# EAGLE design Adafruit LED Arcade Button 1x4 (EAGLE 9.6.2)
COMPANY: ADAFRUIT INDUSTRIES; DRAWN: KTOWN; REV: A
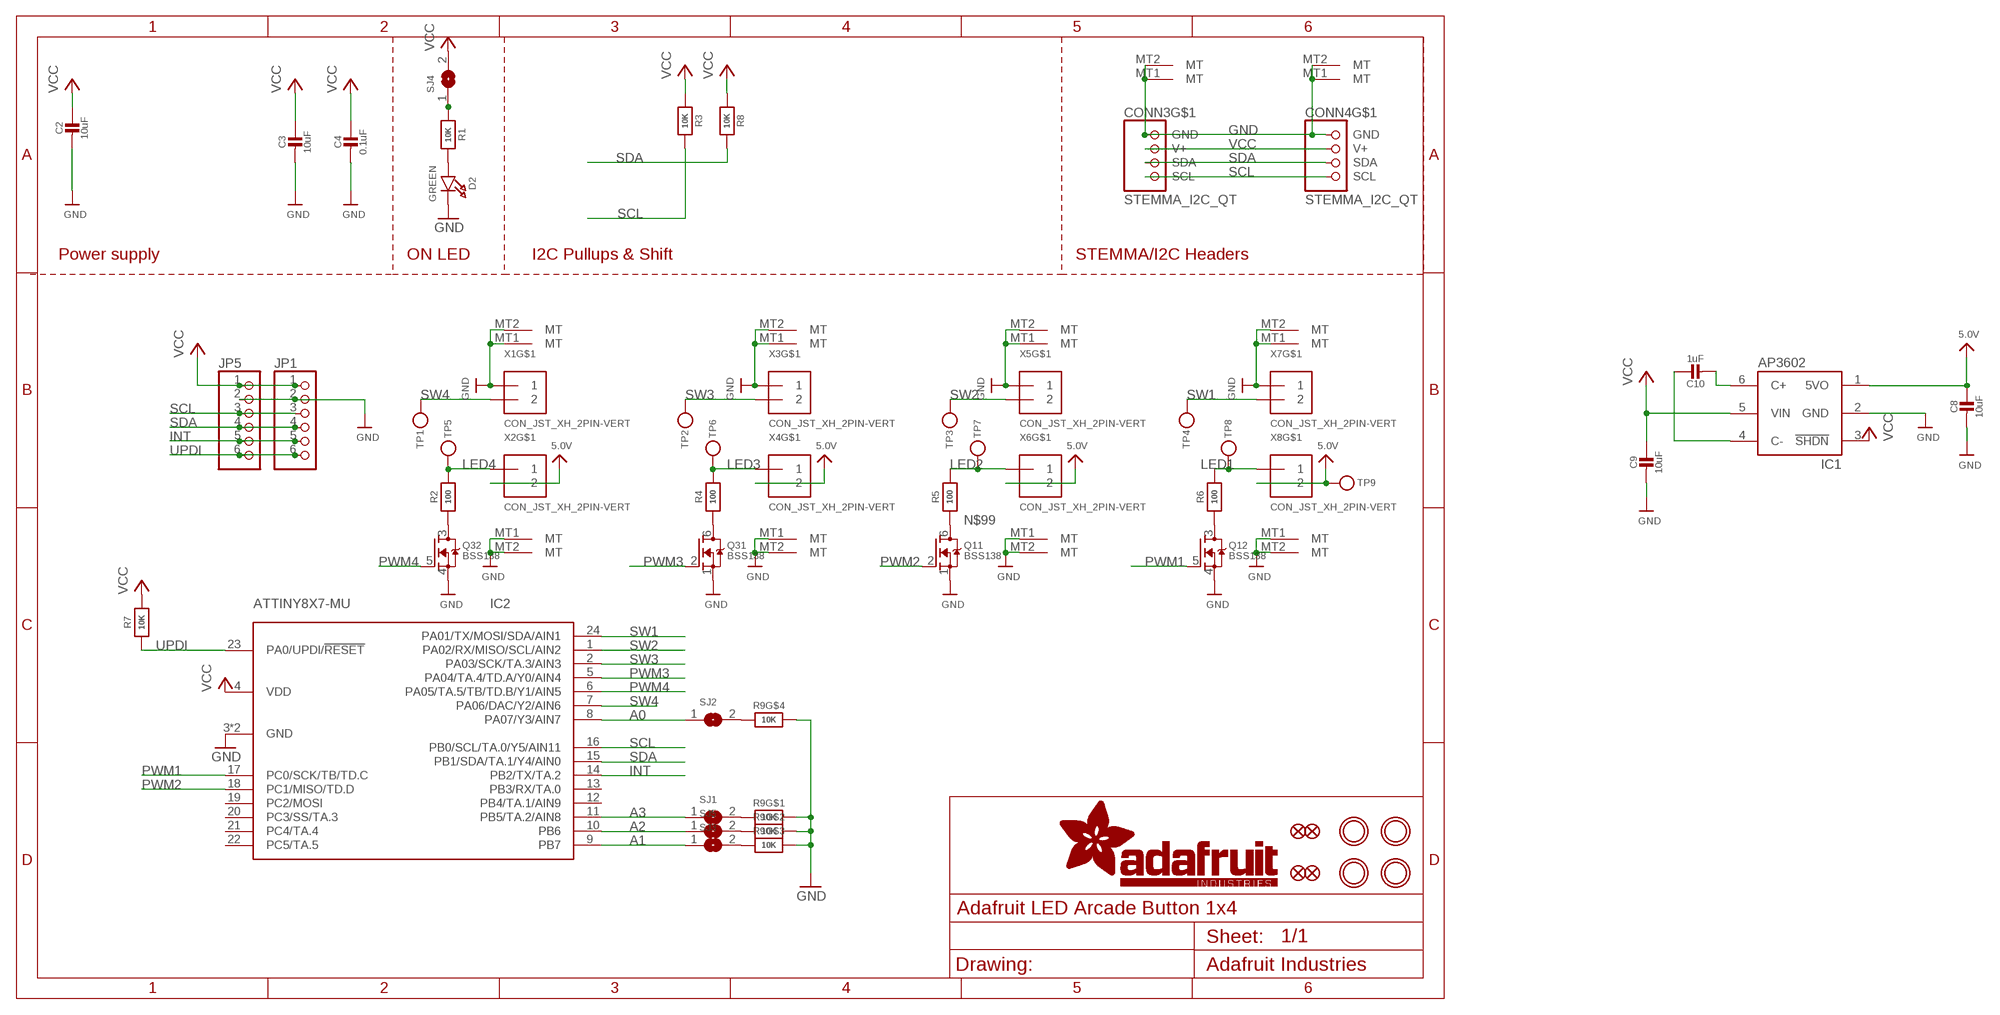
[diagram p0: schematic, sheet 1]

## Parts
C2  10uF  CAP_CERAMIC0805-NOOUTLINE  [0805-NO]
C3  10uF  CAP_CERAMIC0805-NOOUTLINE  [0805-NO]
C4  0.1uF  CAP_CERAMIC0603_NO  [0603-NO]
C8  10uF  CAP_CERAMIC0805-NOOUTLINE  [0805-NO]
C9  10uF  CAP_CERAMIC0805-NOOUTLINE  [0805-NO]
C10  1uF  CAP_CERAMIC0805-NOOUTLINE  [0805-NO]
CONN3  STEMMA_I2C_QT  [JST_SH4]
CONN4  STEMMA_I2C_QT  [JST_SH4]
D2  GREEN  LED0603_NOOUTLINE  [CHIPLED_0603_NOOUTLINE]
FID1  FIDUCIAL_1MM  [FIDUCIAL_1MM]
FID2  FIDUCIAL_1MM  [FIDUCIAL_1MM]
FID3  FIDUCIAL_1MM  [FIDUCIAL_1MM]
FID4  FIDUCIAL_1MM  [FIDUCIAL_1MM]
IC1  AP3602  [SOT23-6]
IC2  ATTINY8X7-MU  [QFN24_4MM]
JP1  HEADER-1X670MIL  [1X06_ROUND_70]
JP5  HEADER-1X670MIL  [1X06_ROUND_70]
Q1  BSS138  MOSFET-N_DUAL  [SOT363]
Q3  BSS138  MOSFET-N_DUAL  [SOT363]
R1  10K  RESISTOR_0603_NOOUT  [0603-NO]
R2  100  RESISTOR_0603_NOOUT  [0603-NO]
R3  10K  RESISTOR_0603_NOOUT  [0603-NO]
R4  100  RESISTOR_0603_NOOUT  [0603-NO]
R5  100  RESISTOR_0603_NOOUT  [0603-NO]
R6  100  RESISTOR_0603_NOOUT  [0603-NO]
R7  10K  RESISTOR_0603_NOOUT  [0603-NO]
R8  10K  RESISTOR_0603_NOOUT  [0603-NO]
R9  10K  RESISTOR_4PACK  [RESPACK_4X0603]
SJ1  SOLDERJUMPERCLOSED  [SOLDERJUMPER_CLOSEDWIRE]
SJ2  SOLDERJUMPERCLOSED  [SOLDERJUMPER_CLOSEDWIRE]
SJ3  SOLDERJUMPERCLOSED  [SOLDERJUMPER_CLOSEDWIRE]
SJ4  SOLDERJUMPERCLOSED  [SOLDERJUMPER_CLOSEDWIRE]
SJ5  SOLDERJUMPERCLOSED  [SOLDERJUMPER_CLOSEDWIRE]
TP1  TESTPOINTROUND1.5MM  [TESTPOINT_ROUND_1.5MM]
TP2  TESTPOINTROUND1.5MM  [TESTPOINT_ROUND_1.5MM]
TP3  TESTPOINTROUND1.5MM  [TESTPOINT_ROUND_1.5MM]
TP4  TESTPOINTROUND1.5MM  [TESTPOINT_ROUND_1.5MM]
TP5  TESTPOINTROUND1.5MM  [TESTPOINT_ROUND_1.5MM]
TP6  TESTPOINTROUND1.5MM  [TESTPOINT_ROUND_1.5MM]
TP7  TESTPOINTROUND1.5MM  [TESTPOINT_ROUND_1.5MM]
TP8  TESTPOINTROUND1.5MM  [TESTPOINT_ROUND_1.5MM]
TP9  TESTPOINTROUND1.5MM  [TESTPOINT_ROUND_1.5MM]
U$3  MOUNTINGHOLE2.5  [MOUNTINGHOLE_2.5_PLATED]
U$17  MOUNTINGHOLE2.5  [MOUNTINGHOLE_2.5_PLATED]
U$19  MOUNTINGHOLE2.5  [MOUNTINGHOLE_2.5_PLATED]
U$21  MOUNTINGHOLE2.5  [MOUNTINGHOLE_2.5_PLATED]
X1  CON_JST_XH_2PIN-VERT  [JST-XH-2-SV]
X2  CON_JST_XH_2PIN-VERT  [JST-XH-2-SV]
X3  CON_JST_XH_2PIN-VERT  [JST-XH-2-SV]
X4  CON_JST_XH_2PIN-VERT  [JST-XH-2-SV]
X5  CON_JST_XH_2PIN-VERT  [JST-XH-2-SV]
X6  CON_JST_XH_2PIN-VERT  [JST-XH-2-SV]
X7  CON_JST_XH_2PIN-VERT  [JST-XH-2-SV]
X8  CON_JST_XH_2PIN-VERT  [JST-XH-2-SV]

## Nets
5.0V: C8.1 IC1.1(5VO) TP9.P$1 X2.2 X4.2 X6.2 X8.2
A0: IC2.8(PA07/Y3/AIN7) SJ2.1
A1: IC2.9(PB7) SJ3.1
A2: IC2.10(PB6) SJ5.1
A3: IC2.11(PB5/TA.2/AIN8) SJ1.1
GND: C2.2 C3.2 C4.2 C8.2 C9.2 CONN3.1(GND) CONN3.MT1(MT) CONN3.MT2(MT) CONN4.1(GND) CONN4.MT1(MT) CONN4.MT2(MT) D2.C IC1.2(GND) IC2.3(GND) IC2.THERM(GND) JP1.2 JP5.2 Q1.1(1:S) Q1.4(2:S) Q3.1(1:S) Q3.4(2:S) R9.5 R9.6 R9.7 R9.8 X1.1 X1.MT1(MT) X1.MT2(MT) X2.MT1(MT) X2.MT2(MT) X3.1 X3.MT1(MT) X3.MT2(MT) X4.MT1(MT) X4.MT2(MT) X5.1 X5.MT1(MT) X5.MT2(MT) X6.MT1(MT) X6.MT2(MT) X7.1 X7.MT1(MT) X7.MT2(MT) X8.MT1(MT) X8.MT2(MT)
INT: IC2.14(PB2/TX/TA.2) JP1.5 JP5.5
LED1: R6.2 TP8.P$1 X8.1
LED2: R5.2 TP7.P$1 X6.1
LED3: R4.2 TP6.P$1 X4.1
LED4: R2.2 TP5.P$1 X2.1
N$1: D2.A R1.2
N$2: C10.2 IC1.6(C+)
N$3: C10.1 IC1.4(C-)
N$4: Q3.6(1:D) R4.1
N$5 [power]: R1.1 SJ4.1
N$6: R9.1 SJ1.2
N$7: R9.2 SJ5.2
N$8: R9.3 SJ3.2
N$11: Q1.3(2:D) R6.1
N$12: Q3.3(2:D) R2.1
N$13: R9.4 SJ2.2
N$99: Q1.6(1:D) R5.1
PWM1: IC2.17(PC0/SCK/TB/TD.C) Q1.5(2:G)
PWM2: IC2.18(PC1/MISO/TD.D) Q1.2(1:G)
PWM3: IC2.5(PA04/TA.4/TD.A/Y0/AIN4) Q3.2(1:G)
PWM4: IC2.6(PA05/TA.5/TB/TD.B/Y1/AIN5) Q3.5(2:G)
SCL: CONN3.4(SCL) CONN4.4(SCL) IC2.16(PB0/SCL/TA.0/Y5/AIN11) JP1.3 JP5.3 R3.2
SDA: CONN3.3(SDA) CONN4.3(SDA) IC2.15(PB1/SDA/TA.1/Y4/AIN0) JP1.4 JP5.4 R8.2
SW1: IC2.24(PA01/TX/MOSI/SDA/AIN1) TP4.P$1 X7.2
SW2: IC2.1(PA02/RX/MISO/SCL/AIN2) TP3.P$1 X5.2
SW3: IC2.2(PA03/SCK/TA.3/AIN3) TP2.P$1 X3.2
SW4: IC2.7(PA06/DAC/Y2/AIN6) TP1.P$1 X1.2
UPDI: IC2.23(PA0/UPDI/!RESET) JP1.6 JP5.6 R7.1
VCC [power]: C2.1 C3.1 C4.1 C9.1 CONN3.2(V+) CONN4.2(V+) IC1.3(!SHDN) IC1.5(VIN) IC2.4(VDD) JP1.1 JP5.1 R3.1 R7.2 R8.1 SJ4.2
Unconnected: IC2.12(PB4/TA.1/AIN9) IC2.13(PB3/RX/TA.0) IC2.19(PC2/MOSI) IC2.20(PC3/SS/TA.3) IC2.21(PC4/TA.4) IC2.22(PC5/TA.5)

## Notes on the sheet
- Power supply | ON LED | I2C Pullups & Shift | STEMMA/I2C Headers

## Library data of the parts
C2-C4 C8-C10 = microbuilder:CAP_CERAMIC: Ceramic Capacitors For new designs, use the packages preceded by an '_' character since they are more reliable: The following footprints should be used on most boards: _0402 - Standard footprint for regular board layouts _0603 - Standard footprint for regular board layouts _0805 - Standard footprint for regular board layouts _1206 - Standard footprint for regular board layouts For extremely tight-pitch boards where space is at a premium, the following 'micro-pitch' footprints can be used (smaller pads, no silkscreen outline, etc.): _0402MP - Micro-pitch footprint for very dense/compact boards _0603MP - Micro-pitch footprint for very dense/compact boards _0805MP - Micro-pitch footprint for very dense/compact boards _1206MP - Micro-pitch footprint for very dense/compact boards
CONN3 CONN4 = microbuilder:STEMMA_I2C
D2 = microbuilder:LED: LED 0603 - 0603 Surface Mount Package 2mA: Green LED - Low Power (3.9mcd, 2ma, 1.7Vf) - Digikey: 475-2709-2-ND Orange LED - Low Power (9.8mcd, 2ma, 1.8Vf) - Digikey: 475-1194-2-ND Red LED - Low Power (5mcd, 2ma, 1.8Vf) - Digikey: 475-1195-2-ND Yellow LED - Low Power (7mcd, 2ma, 1.8Vf) - Digikey: 475-1196-2-ND 5mA: Blue LED - Low Power (17mcd, 5ma, 2.9Vf) - Digikey: LNJ937W8CRACT-ND 0805 - 0805 Surface Mount Package 2mA: Red LED (8.8mcd, 2mA, 1.8Vf, Clear) - Low Power [Digikey: 475-2510-1-ND] Green LED (5mcd, 2mA, 1.8Vf, Clear) - Low Power [Digikey: 475-2730-1-ND] Yellow LED (11.3mcd, 2mA, 1.8Vf, Clear) - Low Power [Digikey: 475-2555-1-ND] 20mA: Red LED (104mcd, 20mA, Diffused) - LS R976 [Digikey: 475-1278-6-ND] Red LED (12mcd, 20mA, 2.0Vf, Clear) - APT2012EC [Digikey: 754-1128-1-ND] Green LED (15mcd, 20mA, 2.2Vf, Clear) - APT2012GC [Digikey: 754-1131-1-ND] Orange LED (160mcd, 20mA, 2.1Vf, Clear) - APT2012SECK [Digikey: 754-1130-1-ND] 1206 - 1206 Surface Mount Package Green LED (26mcd, 20mA, Diffused) - LG N971 [Digikey: 475-1407-6-ND] Red LED (15mcd, 20mA, Diffused) - LH N974 [Digikey: 475-1416-6-ND] Cree - Cree High-Power Surface Mount LEDs XPEBWT-L1-0000-00D50 - White 111lm 350mA 2.9Vf 6200K 110° XTEAWT-00-0000-00000LEE3 - White 114lm 350mA 2.85Vf 5000K 115° Everlight - Everlight 45-21 Series Surface Mount LEDs 45-21/QK2C-B2832AC2CB2/2T - Warm White 2000mcd 20mA 3.25Vf 3050K 120° 45-21/LK2C-B38452C4CB2/2T - Nuetral White 2000mcd 20mA 3.25Vf 4150K 120° 45-21/LK2C-B50634C6CB2/2T - Cold White 2200mcd 20mA 3.25Vf 5650K 120° PLCC2 Reverse Mount LS T77K-J1L2-1-0-2-R18-Z - Red 11.25mcd 2mA 1.8Vf 630nm 120° LO T77K-L1M2-24-Z - Orange 19.6mcd 2mA 1.8Vf 606nm 120° LY T77K-K2M1-26-Z - Yellow 15.7mcd 2mA 1.8Vf 587nm 120°
FID1-FID4 = microbuilder:FIDUCIAL: Fiducial Alignment Points Various fiducial points for machine vision alignment.; BOM: EXCLUDE
IC1 = microbuilder:AP3602
IC2 = adafruit_micro:ATTINY8X7
JP1 JP5 = microbuilder:HEADER-1X6: PIN HEADER
Q1 Q3 = microbuilder:MOSFET-N_DUAL: Dual N-Channel MOSFET SOT363 (2.0x1.25mm) 2N7002PS - 60V, 320mA [Digikey: 568-5984-1-ND]
R1-R8 = microbuilder:RESISTOR: Resistors For new designs, use the packages preceded by an '_' character since they are more reliable: The following footprints should be used on most boards: _0402 - Standard footprint for regular board layouts _0603 - Standard footprint for regular board layouts _0805 - Standard footprint for regular board layouts _1206 - Standard footprint for regular board layouts For extremely tight-pitch boards where space is at a premium, the following 'micro-pitch' footprints can be used (smaller pads, no silkscreen outline, etc.): _0402MP - Micro-pitch footprint for very dense/compact boards _0603MP - Micro-pitch footprint for very dense/compact boards _0805MP - Micro-pitch footprint for very dense/compact boards _1206MP - Micro-pitch footprint for very dense/compact boards
R9 = microbuilder:RESISTOR_4PACK: Resistor Packs (4 resistors) 4 x 0603 10K 1/16W - Digikey: YC164J-10KCT-ND
SJ1-SJ5 = microbuilder:SOLDERJUMPER: SMD Solder JUMPER Solder the two pads together to create a connection, or remove the solder to break it. REFLOW - Use this footprint for solder paste and reflow ovens. WAVE - Use this footprint for hand-soldering (larger pads). CLOSED - Has a trace between the two pads to ensure it is closed by default. The trace needs to be cut to disable the jumper, and can be closed again by creating a solder bridge between the two pads.
TP1-TP9 = microbuilder:TESTPOINT: Test Point Various test points for characterisation and PCB testing TESTPOINT_SMT - Compact Surface Mount Test Point [Digikey: 5016KTR-ND]
U$3 U$17 U$19 U$21 = adafruit_electromech:MOUNTINGHOLE: Mounting Hole For #2 screws (0.086"/2.18mm width, 0.094"/2.4mm hole) use 2.5mm; BOM: EXCLUDE
X1-X8 = adafruit_electromech:CON_JST_XH_2PIN

## Net classes
1 power: width 0.305 mm, drill 0.483 mm
2 lowpower: width 0.254 mm, drill 0.483 mm

## Board
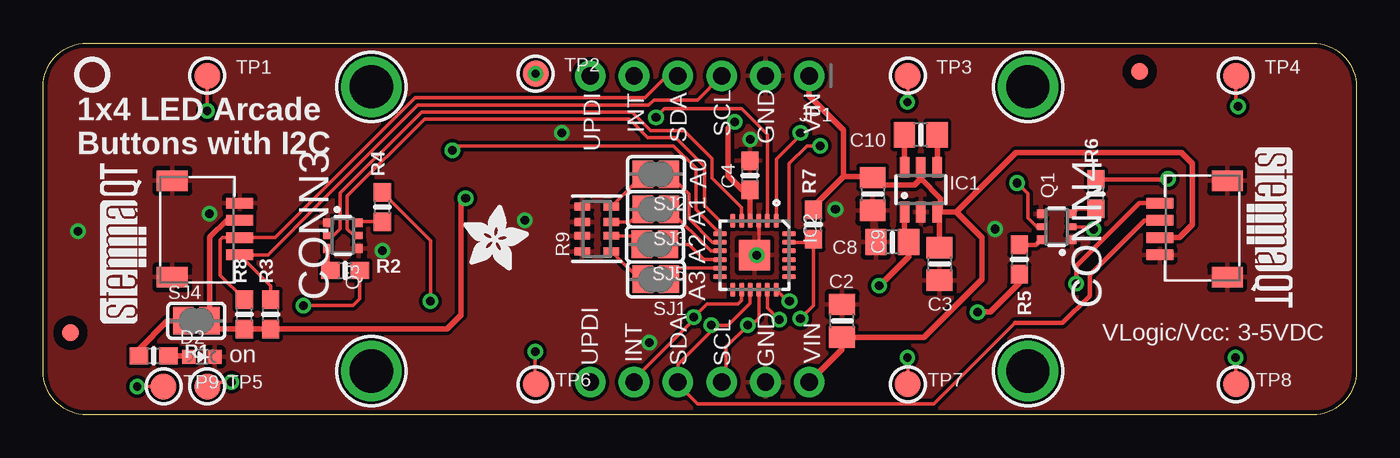
[diagram p1: board, top side]
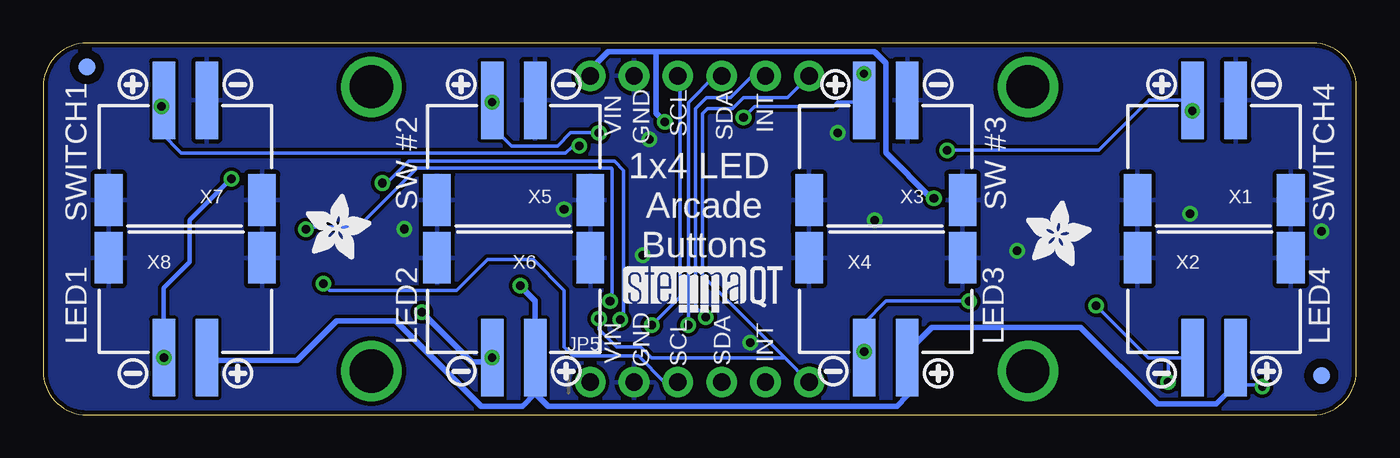
[diagram p2: board, bottom side, seen from below]

Size 76.2 x 21.59 mm. Coordinates in mm from the lower left corner, seen from the top.
Outline: 76.2,19.05 76.2,2.54 arc-90 73.66,0 2.54,0 arc-90 0,2.54 0,19.05 arc-90 2.54,21.59 73.66,21.59 arc-90 76.2,19.05
Copper layers (1*16): Top 0.035mm / dielectric 1.5mm / Bottom 0.035mm
Design rules "adafruit *": minimum track width 8mil, minimum drill 15.5mil, track to track 8mil, track to pad 8mil, pad to pad 8mil, via to via 8mil, smd to smd 8mil, copper to edge 10mil, drill to drill 8mil, minimum pad ring 10mil, minimum via ring 8mil, stop-mask expansion 2mil, vias tented up to drill 20mil, thermal gap 10mil

### Footprints (pad centres in the part's own frame; a part is rotated, then mirrored left to right if it is on the bottom)
0805-NO = smd 1.24 x 1.5: 1 -0.95,0; 2 0.95,0
0603-NO = smd 1.075 x 1: 1 -0.85,0; 2 0.85,0
JST_SH4 = smd 0.6 x 1.55: 1 -1.5,2.514; 2 -0.5,2.514; 3 0.5,2.514; 4 1.5,2.514 | smd 1.2 x 1.8: MT1 -2.8,-1.386; MT2 2.8,-1.386
CHIPLED_0603_NOOUTLINE = smd 0.8 x 0.8: A 0,-0.75; C 0,0.75
FIDUCIAL_1MM = smd 1 x 1: 1 0,0
SOT23-6 = smd 0.55 x 1.2: 1 -0.95,-1.3; 2 0,-1.3; 3 0.95,-1.3; 4 0.95,1.3; 5 0,1.3; 6 -0.95,1.3
QFN24_4MM = smd 0.8 x 0.28: 1 -2,1.25; 2 -2,0.75; 3 -2,0.25; 4 -2,-0.25; 5 -2,-0.75; 6 -2,-1.25; 13 2,-1.25; 14 2,-0.75; 15 2,-0.25; 16 2,0.25; 17 2,0.75; 18 2,1.25 | smd 0.28 x 0.8: 7 -1.25,-2; 8 -0.75,-2; 9 -0.25,-2; 10 0.25,-2; 11 0.75,-2; 12 1.25,-2; 19 1.25,2; 20 0.75,2; 21 0.25,2; 22 -0.25,2; 23 -0.75,2; 24 -1.25,2 | smd 1.778 x 1.778: THERM 0,0
1X06_ROUND_70 = drill 1 pad 1.778: 1 -6.35,0; 2 -3.81,0; 3 -1.27,0; 4 1.27,0; 5 3.81,0; 6 6.35,0
SOT363 = smd 0.5 x 0.5: 1 -0.75,-0.9; 3 0.75,-0.9; 4 0.75,0.9; 6 -0.75,0.9 | smd 0.4 x 0.5: 2 0,-0.9; 5 0,0.9
RESPACK_4X0603 = smd 0.45 x 0.9: 1 -1.3,-0.85; 2 -0.4,-0.85; 3 0.4,-0.85; 4 1.3,-0.85; 5 1.3,0.85; 6 0.4,0.85; 7 -0.4,0.85; 8 -1.3,0.85
SOLDERJUMPER_CLOSEDWIRE = smd 1.168 x 1.6: 1 -0.762,0; 2 0.762,0 | smd 0.635 x 0.203: WIRE 0,0
TESTPOINT_ROUND_1.5MM = smd 1.5 x 1.5: P$1 0,0
MOUNTINGHOLE_2.5_PLATED = drill 2.5 pad 3.2: P$1 0,0
JST-XH-2-SV = smd 1.3 x 4.5: 1 1.25,4.3; 2 -1.25,4.3 | smd 1.6 x 3: MT1 4.45,-1.5; MT2 -4.45,-1.5

### Placement (x,y rotation side)
C2  46.36,5.46 90 top
C3  52.01,8.76 270 top
C4  41.02,13.91 90 top
C8  49.28,10.03 180 top
C9  48.13,12.83 270 top
C10  50.93,16.26 180 top
CONN3  8.89,10.79 270 top
CONN4  67.31,10.79 90 top
D2  9.21,3.37 270 top
FID1  63.63,19.94 0 top
FID2  1.59,4.76 0 top
FID3  2.03,2.29 0 bottom
FID4  73.66,20.19 0 bottom
IC1  50.93,13.08 0 top
IC2  41.27,9.27 270 top
JP1  38.1,19.69 180 top
JP5  38.1,1.9 0 bottom
Q1  58.8,10.92 90 top
Q3  17.4,10.41 270 top
R1  6.41,3.43 0 top
R2  17.53,8.38 0 top
R3  13.21,5.84 90 top
R4  19.69,12.06 90 top
R5  56.64,9.02 270 top
R6  61.09,12.83 90 top
R7  44.7,11.05 90 top
R8  11.68,5.84 90 top
R9  32.13,10.79 90 top
SJ1  35.56,7.87 180 top
SJ2  35.56,13.97 180 top
SJ3  35.56,11.94 180 top
SJ4  8.89,5.46 0 top
SJ5  35.5,9.91 180 top
TP1  9.53,19.69 0 top
TP2  28.58,19.81 0 top
TP3  50.16,19.69 0 top
TP4  69.22,19.69 0 top
TP5  9.53,1.65 0 top
TP6  28.58,1.78 0 top
TP7  50.16,1.78 0 top
TP8  69.22,1.78 0 top
TP9  6.99,1.65 0 top
U$1  [SYMBOL_MINUS]  64.9,19.18 0 bottom
U$2  [ADAFRUIT_3.5MM]  60.96,9.02 0 bottom
U$3  57.15,19.05 0 top
U$7  [SYMBOL_PLUS]  45.85,2.54 0 bottom
U$8  [SYMBOL_MINUS]  24.26,19.18 0 bottom
U$9  [ADAFRUIT_3.5MM]  24.38,8.38 0 top
U$14  [SYMBOL_MINUS]  5.21,19.18 0 bottom
U$15  [SYMBOL_PLUS]  70.99,19.18 0 bottom
U$16  [SYMBOL_PLUS]  64.9,2.41 0 bottom
U$17  19.05,19.05 0 top
U$19  57.15,2.54 0 top
U$20  [SYMBOL_PLUS]  24.26,2.41 0 bottom
U$21  19.05,2.54 0 top
U$23  [SYMBOL_PLUS]  5.21,2.54 0 bottom
U$24  [SYMBOL_PLUS]  11.3,19.18 0 bottom
U$25  [PCBFEAT-REV-040]  2.86,19.75 0 top
U$26  [SYMBOL_PLUS]  51.94,19.18 0 bottom
U$30  [STEMMAQT]  5.97,5.33 90 top
U$31  [STEMMAQT]  69.85,15.49 270 top
U$45  [SYMBOL_MINUS]  11.3,2.41 0 bottom
U$46  [SYMBOL_MINUS]  51.94,2.54 0 bottom
U$47  [SYMBOL_MINUS]  70.99,2.41 0 bottom
U$48  [SYMBOL_MINUS]  30.35,2.54 0 bottom
U$49  [SYMBOL_MINUS]  45.85,19.18 0 bottom
U$50  [SYMBOL_PLUS]  30.23,19.18 0 bottom
U$52  [ADAFRUIT_3.5MM]  19.18,8.64 0 bottom
U$53  [STEMMAQT]  42.55,5.97 0 bottom
X1  8.26,13.97 0 bottom
X2  8.26,7.62 180 bottom
X3  27.3,13.97 0 bottom
X4  27.3,7.62 180 bottom
X5  48.9,13.97 0 bottom
X6  48.9,7.62 180 bottom
X7  67.94,13.97 0 bottom
X8  67.94,7.62 180 bottom

### Tracks (layer width: path | path; a pad name or v marks a point on that pad's centre or on a via)
5.0V  (via drill 0.48, 0.5)
  Top 0.203: TP9.P$1 v5.46,1.65
  Top 0.305: IC1.1 49.98,10.28 C8.1 50.23,9.21 v48.51,7.49
  Bottom 0.203: v5.46,1.65 5.46,1.76 7.01,1.76
  Bottom 0.305: v48.51,7.49 47.65,6.62 X6.2 47.65,1.25 | 47.65,1.25 48.39,0.51 50.8,0.51 55.75,5.46 59.18,5.46 61.47,3.17 66.55,3.17 X8.2 | X2.2 7.01,1.76 8.13,0.63 11.56,0.63 16,5.08 24.64,5.08 26.05,3.66 X4.2 26.05,1.12 26.67,0.51 46.9,0.51 47.65,1.25
A0
  Top 0.203: IC2.8 38.84,10.02 37.47,11.4 37.47,12.83 SJ2.1
A1
  Top 0.203: IC2.9 38.74,9.52 SJ3.1
A2
  Top 0.203: SJ5.1 37.47,9.91 38.35,9.02 IC2.10
A3
  Top 0.203: IC2.11 36.72,8.52 36.32,8.13 SJ1.1
GND  (via drill 0.5)
  Top 0.203: IC2.3 41.52,9.52 IC2.THERM
  other vias: 41.4,9.27 45.97,11.94 55.25,10.79 9.65,11.68 19.69,9.53 2.03,10.67 41.02,16 27.94,11.3 35.18,4.19 30.1,16.38
  pour Bottom: 0,21.59 76.2,21.59 76.2,0 0,0
  pour Top: 0,21.59 76.2,21.59 76.2,0 0,0
INT  (via drill 0.5)
  Top 0.203: IC2.14 40.52,6.65 40.31,6.44 38.52,6.44 v37.76,5.68 37.83,5.61 34.29,2.07 JP5.5
  Bottom 0.203: v37.76,5.68 38.35,6.28 38.35,17.78 37.72,18.41 36.32,18.41 35.05,19.69 JP1.5
LED1  (via drill 0.48, 0.5)
  Top 0.203: TP8.P$1 69.19,1.8 X8.1
  Top 0.254: R6.2 65.28,13.68 v65.28,13.72
  Bottom 0.254: v65.28,13.72 67.69,11.3 67.69,8.89 69.19,7.39 X8.1
  other vias: 69.19,3.32
LED2  (via drill 0.48, 0.5)
  Top 0.203: TP7.P$1 50.16,3.3 X6.1
  Top 0.305: R5.2 56.64,7.66 54.95,5.97 v54.23,5.97
  Bottom 0.305: v54.23,5.97 51.33,3.07 50.4,3.07 X6.1
  other vias: 50.15,3.32
LED3  (via drill 0.48, 0.5)
  Top 0.203: R4.2 22.48,10.12 v22.48,6.6 | TP6.P$1 28.55,1.8 v28.55,3.68
  Bottom 0.203: v22.48,6.6 27.3,6.6 28.55,5.35 v28.55,3.68 X4.1
LED4  (via drill 0.48, 0.5)
  Top 0.203: R2.2 18.38,6.73 18,6.35 v15.11,6.35 | TP5.P$1 9.78,1.9 v10.92,1.9
  Bottom 0.203: v15.11,6.35 12.08,3.32 10.92,3.32 | 10.92,3.32 X2.1 | v10.92,1.9 10.92,3.32
N$1
  Top 0.305: R1.2 8.39,3.43 D2.A
N$2
  Top 0.305: IC1.6 C10.2
N$3
  Top 0.305: IC1.4 C10.1
N$4
  Top 0.203: Q3.6 18.35,11.21 R4.1
N$5
  Top 0.305: R1.1 5.56,3.81 7.21,5.46 SJ4.1
N$6
  Top 0.203: SJ1.2 34.8,7.68 R9.1
N$7
  Top 0.203: R9.2 34.25,10.39 SJ5.2
N$8
  Top 0.203: R9.3 34.05,11.2 SJ3.2
N$11
  Top 0.254: Q1.3 60.01,11.98 R6.1
N$12
  Top 0.254: Q3.3 16.5,8.56 R2.1
N$13
  Top 0.203: R9.4 34.8,13.91 SJ2.2
N$99
  Top 0.254: Q1.6 57.6,9.87 R5.1
PWM1  (via drill 0.5)
  Top 0.203: Q1.5 57.65,10.92 57.14,11.43 57.14,12.84 v56.52,13.46 | v42.7,5.52 42.02,6.21 IC2.17
  Bottom 0.203: v56.52,13.46 56.26,13.46 54.99,14.73 43.05,14.73 42.52,14.2 42.52,5.52 v42.7,5.52
PWM2  (via drill 0.5)
  Top 0.203: v60.96,10.78 60.82,10.92 Q1.2 | IC2.18 43.19,6.6 v43.31,6.6
  Bottom 0.203: v60.96,10.78 v60.96,10.79 60.83,10.92 57.91,10.92 54.51,14.33 43.22,14.33 43.18,14.28 43.18,6.73 v43.31,6.6
PWM3
  Top 0.203: Q3.2 16.87,10.41 17.25,10.79 17.25,12.87 21.96,17.58 34.18,17.58 35.25,16.51 37.17,16.51 38.82,14.87 38.82,13.74 40.52,12.03 IC2.5
PWM4
  Top 0.203: Q3.5 18.03,10.41 17.65,10.79 17.65,12.7 22.12,17.17 34.02,17.17 35.08,16.11 36.69,16.11 38.37,14.42 38.37,12.16 39.26,11.27 IC2.6
SCL  (via drill 0.5)
  Top 0.203: IC2.16 41.52,5.62 41.11,5.21 v40.89,5.21 39.62,3.94 39.62,2.15 JP5.3 | JP1.3 37.97,18.29 35.43,18.29 35.13,17.98 21.74,17.98 16.05,12.29 13.05,9.29 CONN3.4 13.21,7.49 R3.2
  Top 0.254: CONN4.4 63.6,12.29 59.94,8.64 v59.94,7.62
  Bottom 0.203: v59.94,7.62 59.56,7.24 52.2,7.24 50.42,9.02 47.75,9.02 45.97,7.24 45.97,3.94 45.47,3.43 41.66,3.43 40.13,1.9 JP5.3 | v40.89,5.21 39.24,6.85 39.24,19.56 JP1.3
SDA  (via drill 0.5)
  Top 0.203: 56.39,5.33 51.69,0.63 37.97,0.63 36.83,1.78 JP5.4 36.83,2.92 38.76,4.85 v38.76,5.21 39.75,5.21 41.02,6.48 IC2.15 | JP1.4 36.2,19.69 34.93,18.41 21.6,18.41 13.48,10.29 CONN3.3 10.41,10.29 10.29,10.17 10.29,8.09 R8.2
  Top 0.254: CONN4.3 63.89,11.29 60.73,8.14 60.73,6.91 59.15,5.33 56.39,5.33
  Bottom 0.203: v38.76,5.21 38.76,18.13 37.21,19.69 JP1.4
SW1  (via drill 0.48, 0.5)
  Top 0.203: v45.09,15.62 44.31,15.62 43.27,14.59 IC2.24 | TP4.P$1 69.22,18.03 v69.34,17.91
  Bottom 0.203: v45.09,15.62 45.47,15.62 45.87,15.21 68.17,15.21 69.34,16.38 v69.34,17.91 69.34,18.12 X7.2
SW2  (via drill 0.48, 0.5)
  Top 0.203: IC2.1 42.55,11.27 42.55,14.86 43.94,16.26 v43.94,16.38 | TP3.P$1 50.16,18.18 v50.15,18.16
  Bottom 0.203: v43.94,16.38 45.59,16.38 46.36,15.62 49.02,15.62 50.15,16.74 v50.15,18.16 X5.2
SW3  (via drill 0.48, 0.5)
  Top 0.203: v35.56,17.27 36.07,17.78 40.51,17.78 42.02,16.27 IC2.2
  Bottom 0.203: v35.56,17.27 34.93,17.91 30.35,17.91 30.1,18.16 28.66,18.16 X3.2 28.55,19.79 TP2.P$1
  other vias: 28.58,19.81
SW4  (via drill 0.48, 0.5)
  Top 0.203: v23.75,15.37 24,15.62 36.58,15.62 37.88,14.32 37.88,11.92 IC2.7 | TP1.P$1 v9.53,17.65
  Bottom 0.203: v23.75,15.37 14.95,15.37 12.05,18.27 X1.2 9.51,17.67 v9.53,17.65
UPDI  (via drill 0.5)
  Top 0.203: v43.94,5.59 43.94,5.61 44.7,6.37 R7.1 44.53,10.02 IC2.23
  Bottom 0.203: v43.94,5.59 43.94,4.95 42.93,3.94 41.53,3.94 40.89,3.3 33.15,3.3 | 33.15,3.3 JP5.6 | JP1.6 33.02,18.41 35.56,18.41 36.2,17.78 37.65,17.78 37.95,17.48 37.95,8.1 33.15,3.3
VCC  (via drill 0.48, 0.5)
  Top 0.305: JP5.1 46.36,3.81 C2.1 51.12,4.51 54.48,7.87 54.48,10.29 52.99,11.78 | 52.07,11.78 IC1.3 52.01,11.65 C3.1 | 52.07,11.78 52.99,11.78 | IC1.5 50.93,13.72 | 52.07,11.78 52.07,12.57 50.93,13.72 | 50.93,13.72 50.55,13.34 48.58,13.34 C9.1 48.07,13.78 48.01,13.84 46.44,13.84 | JP1.1 44.45,18.54 46.44,16.55 46.44,13.84 | v24.51,12.57 24.26,12.32 24.26,5.8 23.45,4.99 R3.1 R8.1 9.65,4.99 SJ4.2 9.65,10.29 9.7,10.34 9.7,10.35 10.65,11.29 CONN3.2 | 52.99,11.78 56.45,15.24 66.04,15.24 66.67,14.61 66.67,11.05 65.91,10.29 CONN4.2 | IC2.4 C4.1 40.58,13.06 39.75,13.88 39.75,16.64 v40.13,17.02 | R7.2 44.7,12.1 46.44,13.84
  Bottom 0.305: JP1.1 44.45,20.07 43.43,21.08 40.64,21.08 | v24.51,12.57 24.65,12.57 27.3,15.23 27.3,20.42 27.96,21.08 40.64,21.08 | v40.13,17.02 40.64,17.53 40.64,21.08

### Text on the board
tPlace: INT | SCL | GND | VIN | 1x4 LED Arcade / Buttons with I2C | UPDI | SDA | A0 | A1 | A2 | A3 | UPDI | SDA | GND | VLogic/Vcc: 3-5VDC | INT | SCL | VIN | on
bPlace: INT | SDA | SCL | GND | VIN | SWITCH4 | SW #3 | SW #2 | SWITCH1 | 1x4 LED / Arcade / Buttons | LED4 | LED3 | LED2 | LED1 | SDA | GND | INT | SCL | VIN